# EAGLE design ddpd (EAGLE 6.5.0)
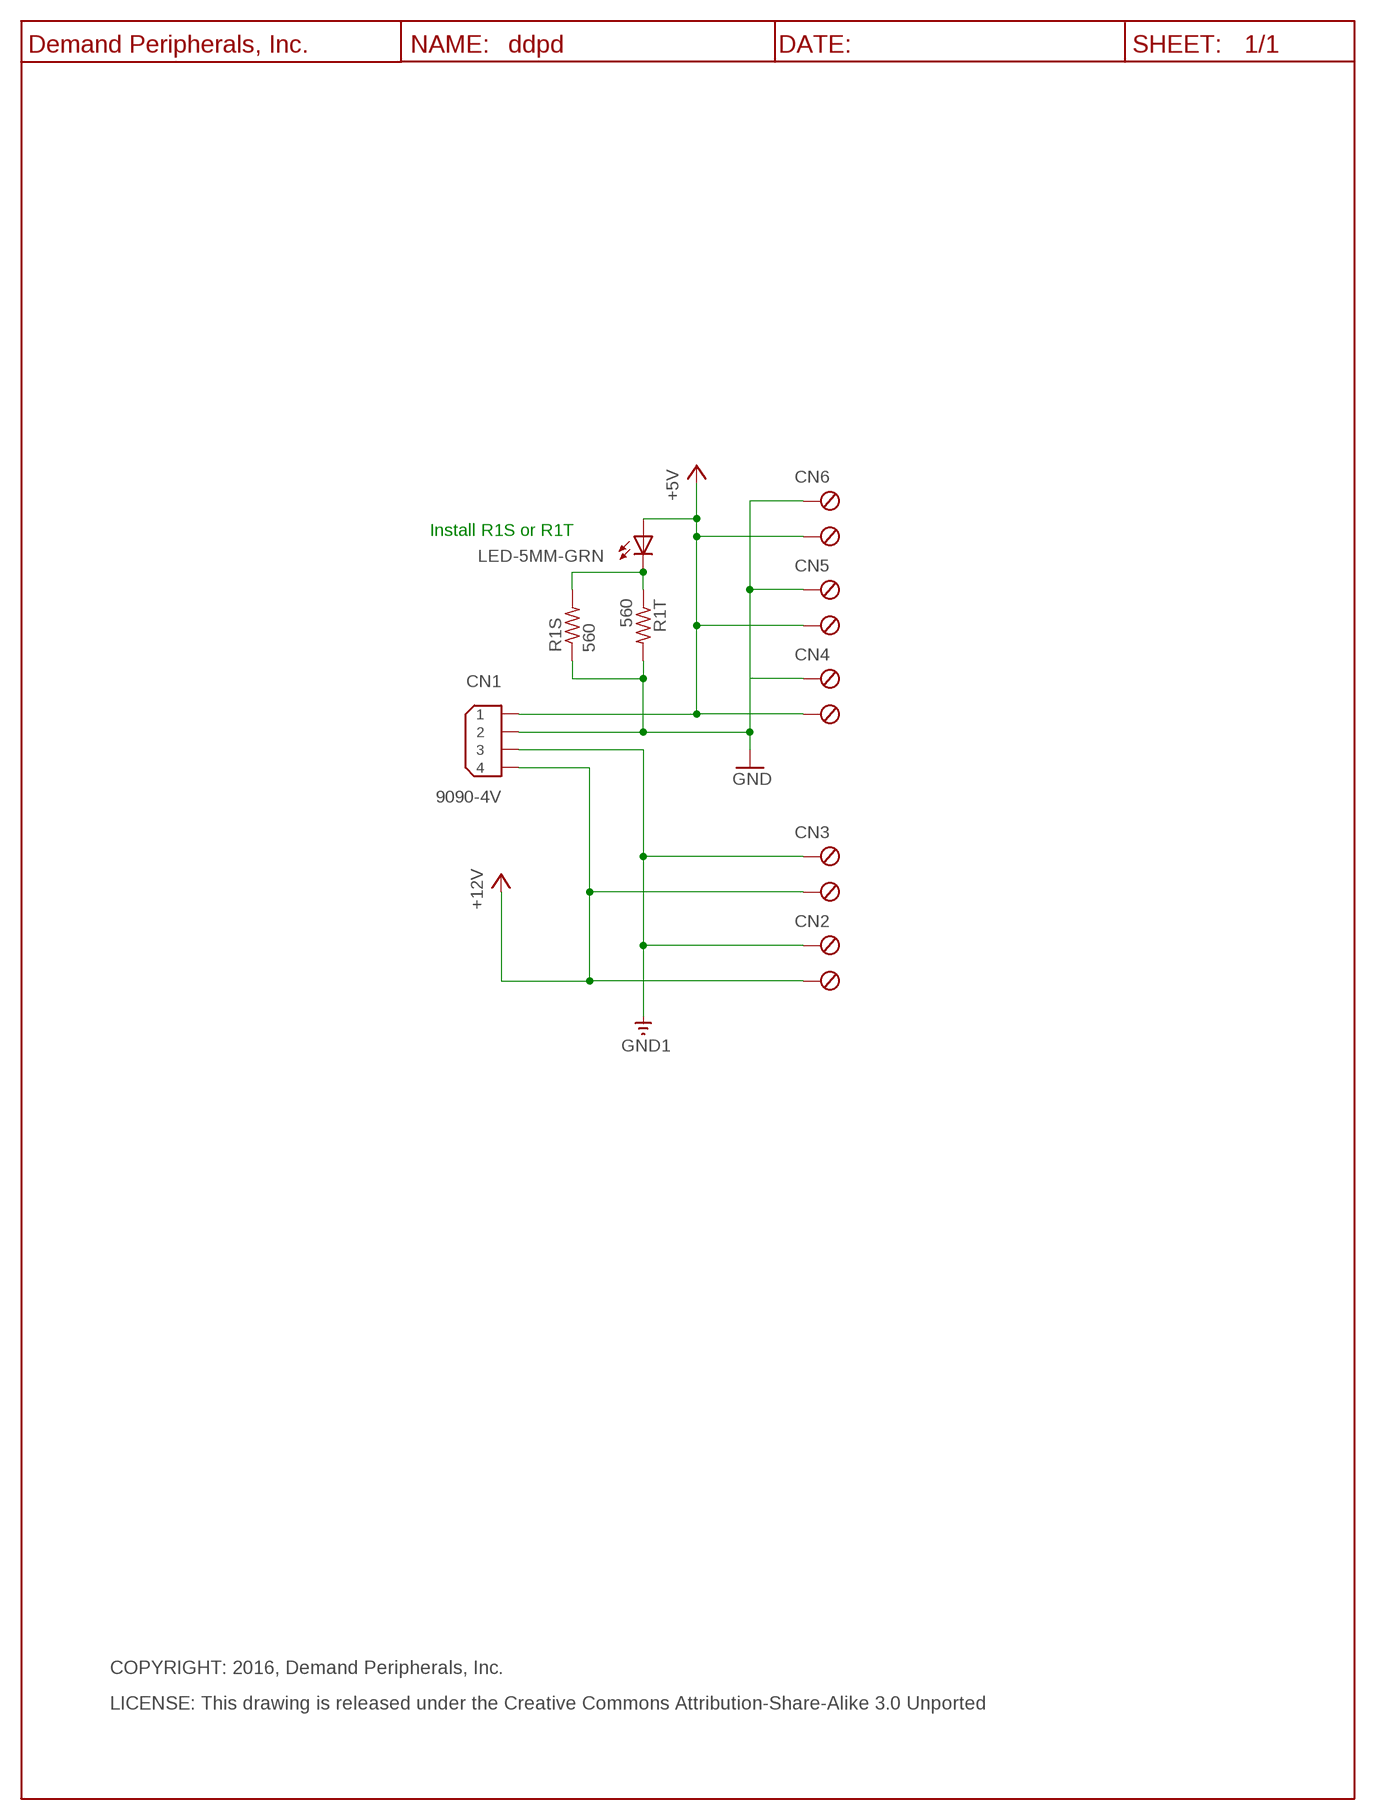
[diagram p0: schematic, sheet 1]

## Parts
+5V  LED-5MM-GRN  [LED5MM]
CN1  9090-4V  9090-4R  [9090-4R]
CN2  TBLK-5.08-X2  [TBLK-5.08-X2]
CN3  TBLK-5.08-X2  [TBLK-5.08-X2]
CN4  TBLK-5.08-X2  [TBLK-5.08-X2]
CN5  TBLK-5.08-X2  [TBLK-5.08-X2]
CN6  TBLK-5.08-X2  [TBLK-5.08-X2]
R1S  560  R560_R0603  [R0603]
R1T  560  R560_  [R4TENTHS]
U$4  DP_FRAME_P  [LETTER_P]

## Nets
+5V: +5V.A CN1.1 CN4.2(KL1) CN5.2(KL1) CN6.2(KL1)
+5V/2: CN1.4 CN2.2(KL1) CN3.2(KL1) ; supply symbol labelled +12V
GND: CN1.2 CN4.1(KL) CN5.1(KL) CN6.1(KL) R1S.1 R1T.2
GND1: CN1.3 CN2.1(KL) CN3.1(KL)
N$5: +5V.C R1S.2 R1T.1

## Notes on the sheet
- Install R1S or R1T
- COPYRIGHT: 2016, Demand Peripherals, Inc.
- LICENSE: This drawing is released under the Creative Commons Attribution-Share-Alike 3.0 Unported

## Library data of the parts
+5V = dpi-diopto:LED-5MM-GRN: Green LED, 5 MM, through-hole; VENDOR: Digikey; VENDOR-PART-NUM: 160-1852-ND
CN1 = dpi-conn:9090-4: Disk Drive Power, 4 position; VENDOR: Mouser; VENDOR-PART-NUM: 538-15-24-4441
CN2-CN6 = dpi-conn:TBLK-5.08-X2: Terminal Block, 5.08mm, x2, screw terminals; VENDOR: Digikey; VENDOR-PART-NUM: ED2609-ND
R1S = dpi-passive:R560_: 560 Ohm resistor, 1%, 0.1 watt; VENDOR: Digikey; VENDOR-PART-NUM: 311-560HRTR-ND
R1T = dpi-passive:R560_: 560 Ohm resistor, 1%, 0.1 watt; VENDOR: Digikey; VENDOR-PART-NUM: CF18JT560RCT-ND
U$4 = DP:DP_FRAME_P: Portrait/Letter Document Frame

## Board
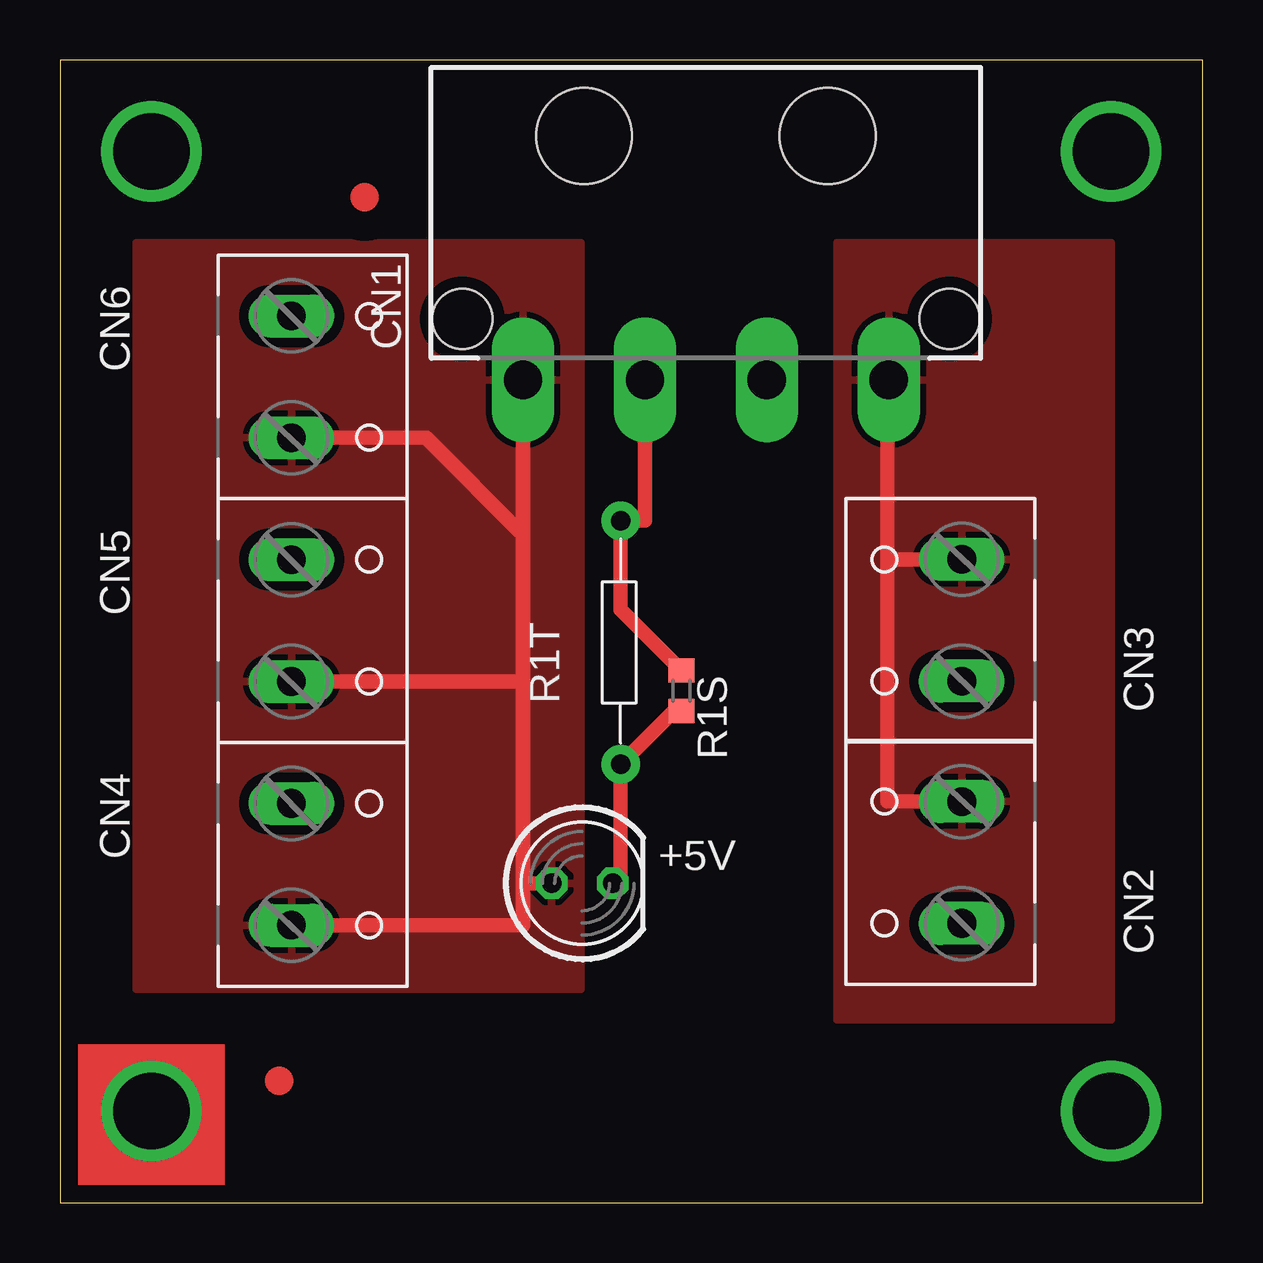
[diagram p1: board, top side]
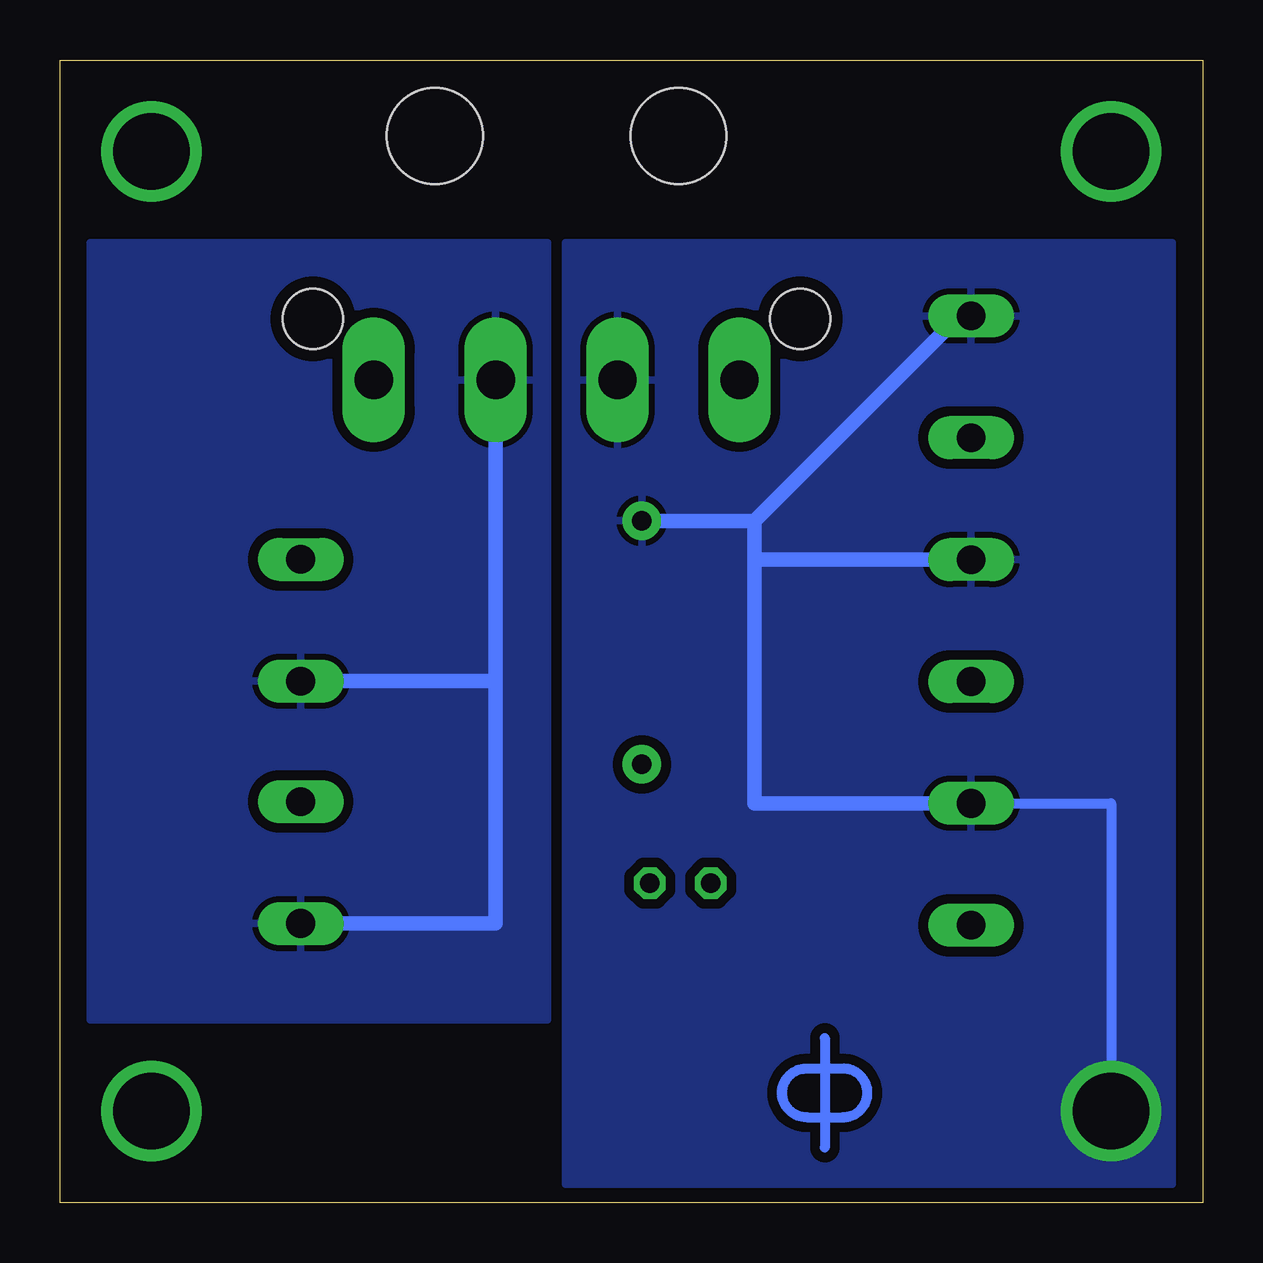
[diagram p2: board, bottom side, seen from below]

Size 47.62 x 47.62 mm. Coordinates in mm from the lower left corner, seen from the top.
Outline: 0,0 47.62,0 47.62,47.62 0,47.62 0,0
Copper layers (1*16): Top 0.035mm / dielectric 1.5mm / Bottom 0.035mm
Design rules "default": minimum track width 10mil, minimum drill 24mil, track to track 8mil, track to pad 8mil, pad to pad 8mil, via to via 8mil, smd to smd 8mil, copper to edge 20mil, drill to drill 8mil, minimum pad ring 10mil, minimum via ring 8mil, stop-mask expansion 4mil, vias tented up to drill 0mil, thermal gap 10mil

### Footprints (pad centres in the part's own frame; a part is rotated, then mirrored left to right if it is on the bottom)
LED5MM = drill 0.813 octagon: A -1.27,0; C 1.27,0
9090-4R = drill 1.6 pad 2.6 long: 1 -7.62,-6.35; 2 -2.54,-6.35; 3 2.54,-6.35; 4 7.62,-6.35 | hole 4: -5.08,3.81; 5.08,3.81 | hole 2.5: -10.16,-3.81; 10.16,-3.81
TBLK-5.08-X2 = drill 1.194 long: 1 -2.54,-0.127; 2 2.54,-0.127
R0603 = smd 1 x 1.1: 1 -0.85,0; 2 0.85,0
R4TENTHS = drill 0.813 pad 1.6: 1 -5.08,0; 2 5.08,0

### Placement (x,y rotation side)
+5V  21.77,13.31 0 top
CN1  26.92,40.64 0 top
CN2  37.47,14.17 90 top
CN3  37.47,24.27 90 top
CN4  9.78,14.1 270 top
CN5  9.78,24.26 270 top
CN6  9.78,34.42 270 top
R1S  25.91,21.34 270 top
R1T  23.37,23.34 90 top
U$1  [DPI-1]  15.75,4.57 0 bottom
U$2  [FIDUCIAL]  9.14,5.08 0 top
U$3  [FIDUCIAL]  12.7,41.91 180 top
U$4  -2.54,-2.54 0 top

### Tracks (layer width: path | path; a pad name or v marks a point on that pad's centre or on a via)
+5V
  Top 0.61: CN5.2 19.3,21.72 19.3,21.75 | 19.3,21.75 19.3,27.83 | 19.3,27.83 19.3,34.43 | 19.3,34.43 CN1.1 | 19.3,34.43 19.3,31.88 | CN4.2 19.3,11.56 19.3,13.28 | 19.3,13.28 19.3,21.75 | +5V.A 19.3,13.31 19.3,13.28 | CN6.2 15.25,31.88 19.3,27.83
  pour Top (isolate 0.406): 21.72,40.01 21.72,8.89 3.17,8.89 3.17,40.01
+5V/2
  Top 0.61: CN1.4 34.49,34.47 34.49,26.73 | CN3.2 34.49,26.81 34.49,26.73 | CN2.2 34.49,16.71 34.49,26.73
  pour Top (isolate 0.406): 43.81,40.01 43.81,7.62 32.38,7.62 32.38,40.01
GND  (via drill 3.17 pad 3.17)
  Top 0.61: R1S.1 23.37,24.73 R1T.2 24.38,28.42 CN1.2
  Bottom 0.406: CN4.1 3.81,16.64 v3.81,3.81
  Bottom 0.61: CN6.1 10.13,36.96 18.68,28.41 | 18.68,28.41 23.36,28.41 R1T.2 | 18.68,26.8 CN5.1 | 18.68,26.8 18.68,28.41 | CN4.1 18.68,16.64 18.68,26.8
  pour Bottom (isolate 0.406): 26.54,40.01 26.54,0.76 1.27,0.76 1.27,40.01
GND1
  Bottom 0.61: 29.46,21.73 CN1.3 | 29.46,21.73 CN3.1 | CN2.1 29.46,11.63 29.46,21.73
  pour Bottom (isolate 0.406): 46.35,40.01 46.35,7.62 27.3,7.62 27.3,40.01
MOUNT  (via drill 3.17 pad 3.17)
  other vias: 43.81,43.81
N$4  (via drill 3.17 pad 3.17)
  other vias: 3.81,43.81
N$5
  Top 0.61: R1S.2 25.59,20.49 R1T.1 23.37,13.64 +5V.C
N$6  (via drill 3.17 pad 3.17)
  other vias: 43.81,3.81
(copper drawn outside any net)
  shapes: Top area x1

### Text on the board
tTest: 1.875 Inches | 1.575 Inches | 5V | R1T | 12V | 5V | R1S | 1.575 Inches | 1.875 Inches | 12V | 5V | (C) 2017, Demand Peripherals, Inc. | DDPD, Rev 17A